# Altium schematic sheet SEAx_connector.SchDoc
size A3
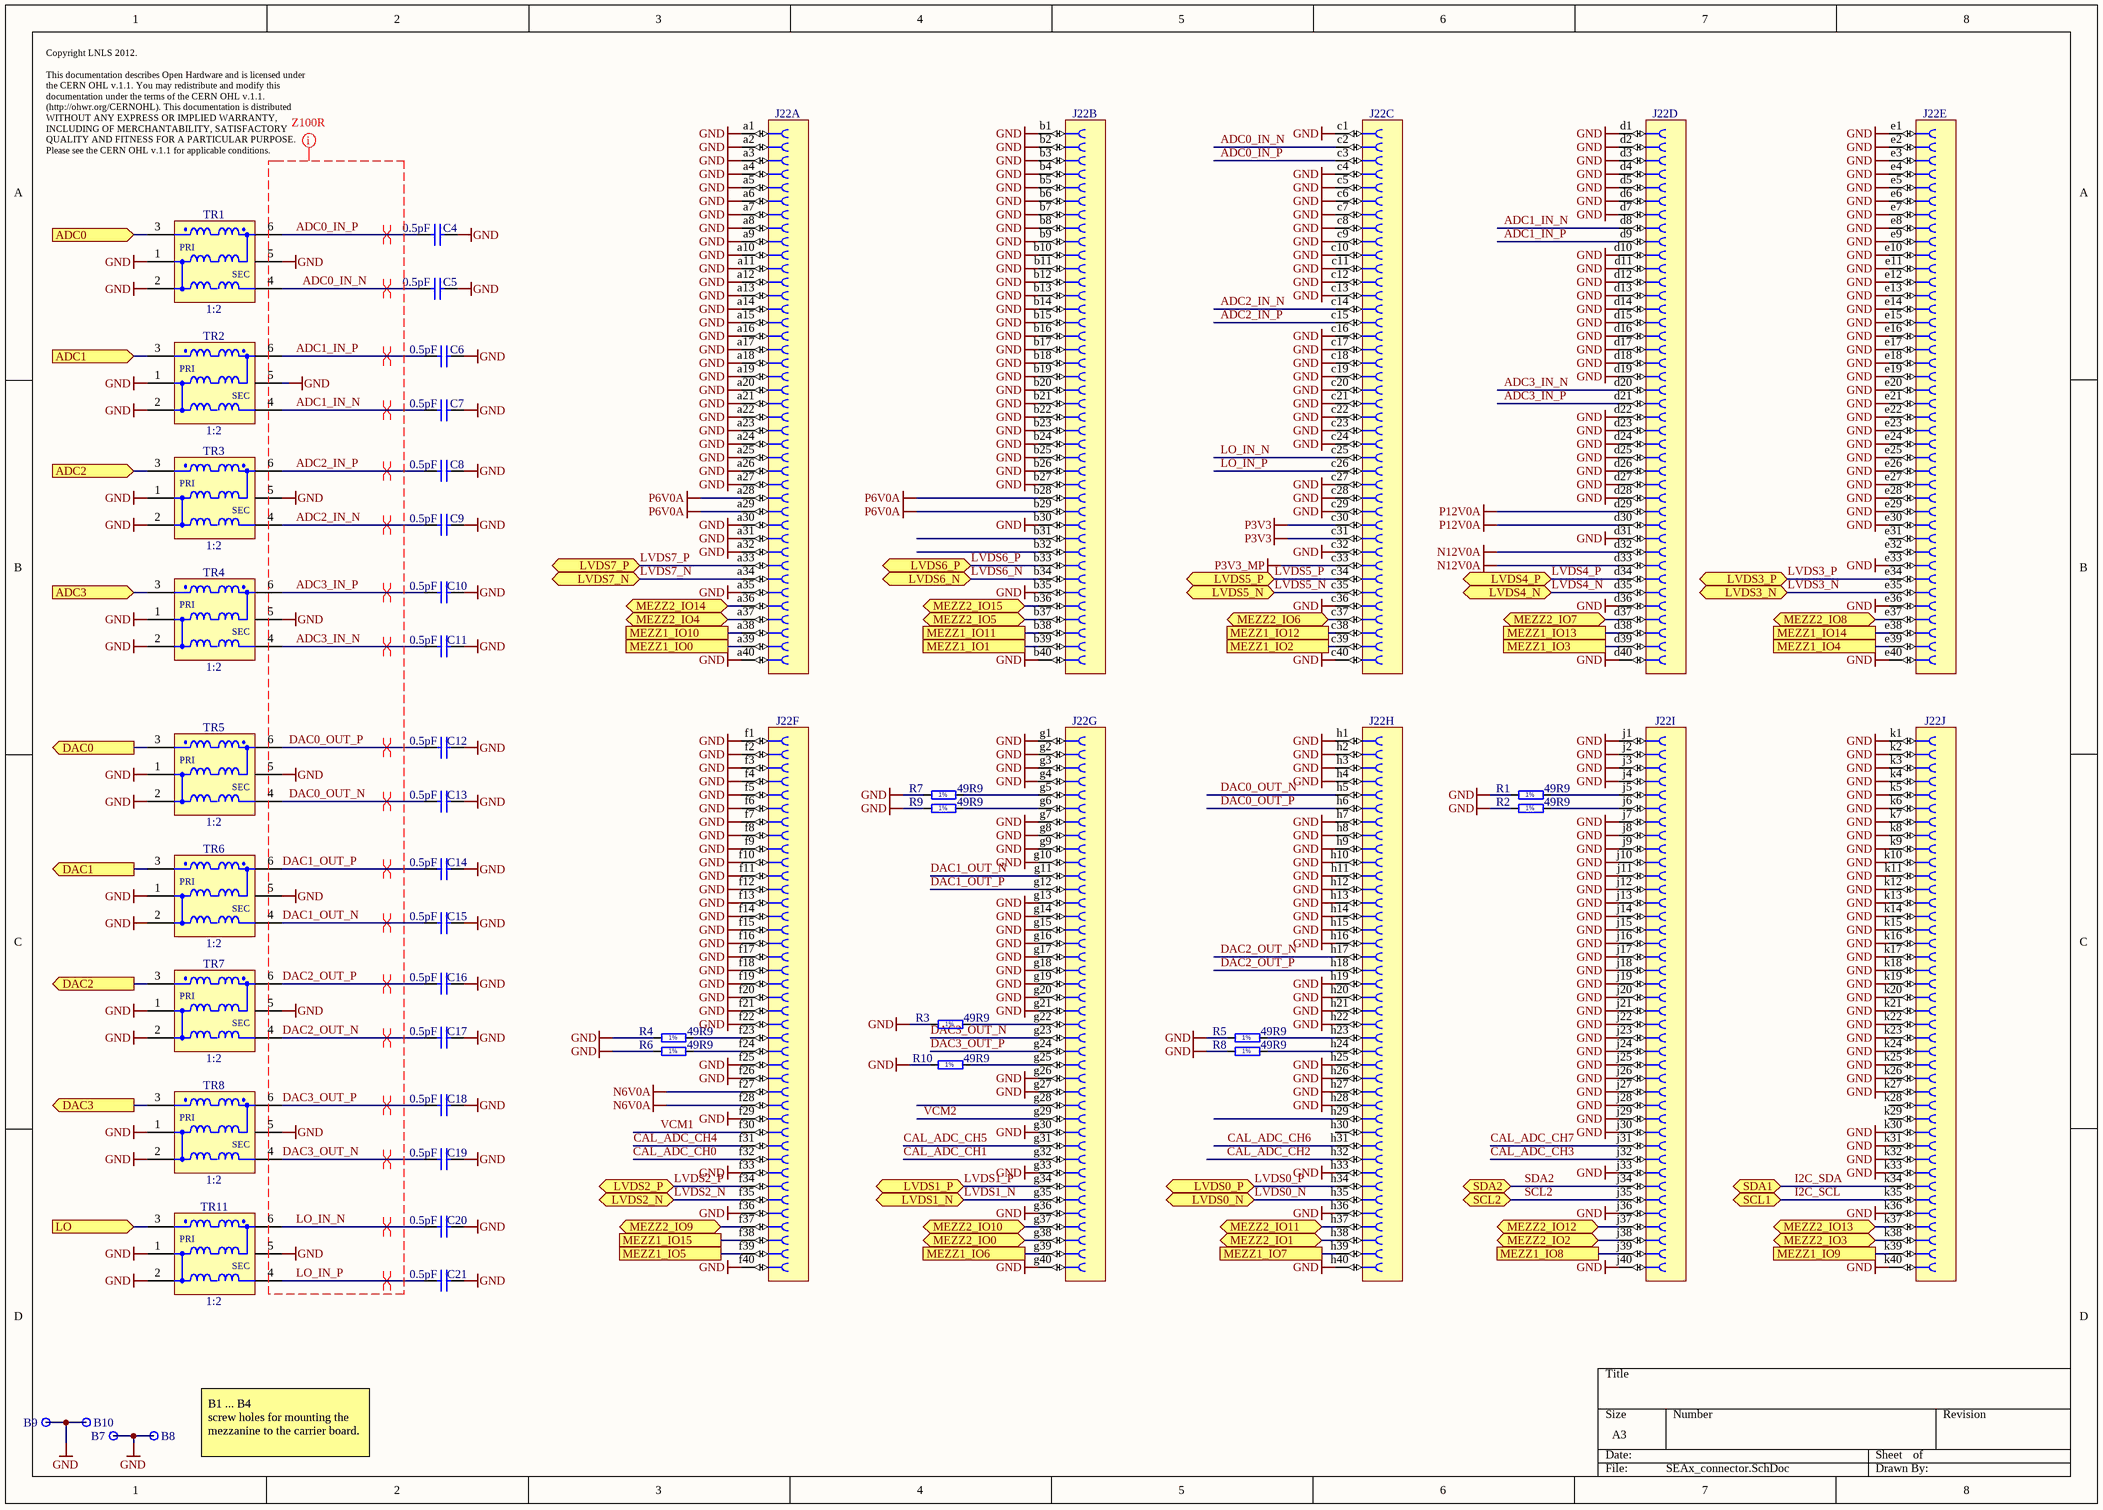
[diagram p0: SEAx_connector.SchDoc]

## Parts
B7  Plated Hole  [MTG270_500]  (value not drawn)
B8  Plated Hole  [MTG270_500]  (value not drawn)
B9  Plated Hole  [MTG270_500]  (value not drawn)
B10  Plated Hole  [MTG270_500]  (value not drawn)
C4  0.5pF  [CAPC1005X50N]
C5  0.5pF  [CAPC1005X50N]
C6  0.5pF  [CAPC1005X50N]
C7  0.5pF  [CAPC1005X50N]
C8  0.5pF  [CAPC1005X50N]
C9  0.5pF  [CAPC1005X50N]
C10  0.5pF  [CAPC1005X50N]
C11  0.5pF  [CAPC1005X50N]
C12  0.5pF  [CAPC1005X50N]
C13  0.5pF  [CAPC1005X50N]
C14  0.5pF  [CAPC1005X50N]
C15  0.5pF  [CAPC1005X50N]
C16  0.5pF  [CAPC1005X50N]
C17  0.5pF  [CAPC1005X50N]
C18  0.5pF  [CAPC1005X50N]
C19  0.5pF  [CAPC1005X50N]
C20  0.5pF  [CAPC1005X50N]
C21  0.5pF  [CAPC1005X50N]
J22  VITA 57  [SAMTEC_ASP-134486-01]  (value not drawn)  (parts A,B,C,D,E,F,G,H,I,J of 10)
R1  49R9  [RESC1005X40N]
R2  49R9  [RESC1005X40N]
R3  49R9  [RESC1005X40N]
R4  49R9  [RESC1005X40N]
R5  49R9  [RESC1005X40N]
R6  49R9  [RESC1005X40N]
R7  49R9  [RESC1005X40N]
R8  49R9  [RESC1005X40N]
R9  49R9  [RESC1005X40N]
R10  49R9  [RESC1005X40N]
TR1  1:2  [XFMR_MINI-CIRCUITS_DB1627]
TR2  1:2  [XFMR_MINI-CIRCUITS_DB1627]
TR3  1:2  [XFMR_MINI-CIRCUITS_DB1627]
TR4  1:2  [XFMR_MINI-CIRCUITS_DB1627]
TR5  1:2  [XFMR_MINI-CIRCUITS_DB1627]
TR6  1:2  [XFMR_MINI-CIRCUITS_DB1627]
TR7  1:2  [XFMR_MINI-CIRCUITS_DB1627]
TR8  1:2  [XFMR_MINI-CIRCUITS_DB1627]
TR11  1:2  [XFMR_MINI-CIRCUITS_DB1627]

## Ports
ADC0 (in), ADC1 (in), ADC2 (in), ADC3 (in), DAC0 (out), DAC1 (out), DAC2 (out), DAC3 (out), LO (in), LVDS0_N (bidir), LVDS0_P (bidir), LVDS1_N (bidir), LVDS1_P (bidir), LVDS2_N (bidir), LVDS2_P (bidir), LVDS3_N (bidir), LVDS3_P (bidir), LVDS4_N (bidir), LVDS4_P (bidir), LVDS5_N (bidir), LVDS5_P (bidir), LVDS6_N (bidir), LVDS6_P (bidir), LVDS7_N (bidir), LVDS7_P (bidir), MEZZ1_IO0, MEZZ1_IO1, MEZZ1_IO2, MEZZ1_IO3, MEZZ1_IO4, MEZZ1_IO5, MEZZ1_IO6, MEZZ1_IO7, MEZZ1_IO8, MEZZ1_IO9, MEZZ1_IO10, MEZZ1_IO11, MEZZ1_IO12, MEZZ1_IO13, MEZZ1_IO14, MEZZ1_IO15, MEZZ2_IO0 (bidir), MEZZ2_IO1 (bidir), MEZZ2_IO2 (bidir), MEZZ2_IO3 (bidir), MEZZ2_IO4 (bidir), MEZZ2_IO5 (bidir), MEZZ2_IO6 (bidir), MEZZ2_IO7 (bidir), MEZZ2_IO8 (bidir), MEZZ2_IO9 (bidir), MEZZ2_IO10 (bidir), MEZZ2_IO11 (bidir), MEZZ2_IO12 (bidir), MEZZ2_IO13 (bidir), MEZZ2_IO14 (bidir), MEZZ2_IO15 (bidir), SCL1 (bidir), SCL2 (bidir), SDA1 (bidir), SDA2 (bidir)

## Nets
GND: B7.1 B8.1 B9.1 B10.1 C4.2 C5.2 C6.2 C7.2 C8.2 C9.2 C10.2 C11.2 C12.2 C13.2 C14.2 C15.2 C16.2 C17.2 C18.2 C19.2 C20.2 C21.2 J22.a1 J22.a2 J22.a3 J22.a4 J22.a5 J22.a6 J22.a7 J22.a8 J22.a9 J22.a10 J22.a11 J22.a12 J22.a13 J22.a14 J22.a15 J22.a16 J22.a17 J22.a18 J22.a19 J22.a20 J22.a21 J22.a22 J22.a23 J22.a24 J22.a25 J22.a26 J22.a27 J22.a30 J22.a31 J22.a32 J22.a35 J22.a40 J22.b1 J22.b2 J22.b3 J22.b4 J22.b5 J22.b6 J22.b7 J22.b8 J22.b9 J22.b10 J22.b11 J22.b12 J22.b13 J22.b14 J22.b15 J22.b16 J22.b17 J22.b18 J22.b19 J22.b20 J22.b21 J22.b22 J22.b23 J22.b24 J22.b25 J22.b26 J22.b27 J22.b30 J22.b35 J22.b40 J22.c1 J22.c4 J22.c5 J22.c6 J22.c7 J22.c8 J22.c9 J22.c10 J22.c11 J22.c12 J22.c13 J22.c16 J22.c17 J22.c18 J22.c19 J22.c20 J22.c21 J22.c22 J22.c23 J22.c24 J22.c27 J22.c28 J22.c29 J22.c32 J22.c36 J22.c40 J22.d1 J22.d2 J22.d3 J22.d4 J22.d5 J22.d6 J22.d7 J22.d10 J22.d11 J22.d12 J22.d13 J22.d14 J22.d15 J22.d16 J22.d17 J22.d18 J22.d19 J22.d22 J22.d23 J22.d24 J22.d25 J22.d26 J22.d27 J22.d28 J22.d31 J22.d36 J22.d40 J22.e1 J22.e2 J22.e3 J22.e4 J22.e5 J22.e6 J22.e7 J22.e8 J22.e9 J22.e10 J22.e11 J22.e12 J22.e13 J22.e14 J22.e15 J22.e16 J22.e17 J22.e18 J22.e19 J22.e20 J22.e21 J22.e22 J22.e23 J22.e24 J22.e25 J22.e26 J22.e27 J22.e28 J22.e29 J22.e30 J22.e33 J22.e36 J22.e40 J22.f1 J22.f2 J22.f3 J22.f4 J22.f5 J22.f6 J22.f7 J22.f8 J22.f9 J22.f10 J22.f11 J22.f12 J22.f13 J22.f14 J22.f15 J22.f16 J22.f17 J22.f18 J22.f19 J22.f20 J22.f21 J22.f22 J22.f25 J22.f26 J22.f29 J22.f33 J22.f36 J22.f40 J22.g1 J22.g2 J22.g3 J22.g4 J22.g7 J22.g8 J22.g9 J22.g10 J22.g13 J22.g14 J22.g15 J22.g16 J22.g17 J22.g18 J22.g19 J22.g20 J22.g21 J22.g26 J22.g27 J22.g30 J22.g33 J22.g36 J22.g40 J22.h1 J22.h2 J22.h3 J22.h4 J22.h7 J22.h8 J22.h9 J22.h10 J22.h11 J22.h12 J22.h13 J22.h14 J22.h15 J22.h16 J22.h19 J22.h20 J22.h21 J22.h22 J22.h25 J22.h26 J22.h27 J22.h28 J22.h33 J22.h36 J22.h40 J22.j1 J22.j2 J22.j3 J22.j4 J22.j7 J22.j8 J22.j9 J22.j10 J22.j11 J22.j12 J22.j13 J22.j14 J22.j15 J22.j16 J22.j17 J22.j18 J22.j19 J22.j20 J22.j21 J22.j22 J22.j23 J22.j24 J22.j25 J22.j26 J22.j27 J22.j28 J22.j29 J22.j30 J22.j33 J22.j36 J22.j40 J22.k1 J22.k2 J22.k3 J22.k4 J22.k5 J22.k6 J22.k7 J22.k8 J22.k9 J22.k10 J22.k11 J22.k12 J22.k13 J22.k14 J22.k15 J22.k16 J22.k17 J22.k18 J22.k19 J22.k20 J22.k21 J22.k22 J22.k23 J22.k24 J22.k25 J22.k26 J22.k27 J22.k30 J22.k31 J22.k32 J22.k33 J22.k36 J22.k40 R1.1 R2.1 R3.1 R4.1 R5.1 R6.1 R7.1 R8.1 R9.1 R10.1 TR1.1(P1) TR1.2(P1) TR1.5(NC) TR2.1(P1) TR2.2(P1) TR2.5(NC) TR3.1(P1) TR3.2(P1) TR3.5(NC) TR4.1(P1) TR4.2(P1) TR4.5(NC) TR5.1(P1) TR5.2(P1) TR5.5(NC) TR6.1(P1) TR6.2(P1) TR6.5(NC) TR7.1(P1) TR7.2(P1) TR7.5(NC) TR8.1(P1) TR8.2(P1) TR8.5(NC) TR11.1(P1) TR11.2(P1) TR11.5(NC)
N6V0A: J22.f27 J22.f28
N12V0A: J22.d32 J22.d33
P3V3: J22.c30 J22.c31
P3V3_MP: J22.c33
P6V0A: J22.a28 J22.a29 J22.b28 J22.b29
P12V0A: J22.d29 J22.d30
ADC0: TR1.3(P1) ; port ADC0
ADC0_IN_N: C5.1 J22.c2 TR1.4(S1)
ADC0_IN_P: C4.1 J22.c3 TR1.6(S1)
ADC1: TR2.3(P1) ; port ADC1
ADC1_IN_N: C7.1 J22.d8 TR2.4(S1)
ADC1_IN_P: C6.1 J22.d9 TR2.6(S1)
ADC2: TR3.3(P1) ; port ADC2
ADC2_IN_N: C9.1 J22.c14 TR3.4(S1)
ADC2_IN_P: C8.1 J22.c15 TR3.6(S1)
ADC3: TR4.3(P1) ; port ADC3
ADC3_IN_N: C11.1 J22.d20 TR4.4(S1)
ADC3_IN_P: C10.1 J22.d21 TR4.6(S1)
CAL_ADC_CH0: J22.f32
CAL_ADC_CH1: J22.g32
CAL_ADC_CH2: J22.h32
CAL_ADC_CH3: J22.j32
CAL_ADC_CH4: J22.f31
CAL_ADC_CH5: J22.g31
CAL_ADC_CH6: J22.h31
CAL_ADC_CH7: J22.j31
DAC0: TR5.3(P1) ; port DAC0
DAC0_OUT_N: C13.1 J22.h5 TR5.4(S1)
DAC0_OUT_P: C12.1 J22.h6 TR5.6(S1)
DAC1: TR6.3(P1) ; port DAC1
DAC1_OUT_N: C15.1 J22.g11 TR6.4(S1)
DAC1_OUT_P: C14.1 J22.g12 TR6.6(S1)
DAC2: TR7.3(P1) ; port DAC2
DAC2_OUT_N: C17.1 J22.h17 TR7.4(S1)
DAC2_OUT_P: C16.1 J22.h18 TR7.6(S1)
DAC3: TR8.3(P1) ; port DAC3
DAC3_OUT_N: C19.1 J22.g23 TR8.4(S1)
DAC3_OUT_P: C18.1 J22.g24 TR8.6(S1)
I2C_SCL: J22.k35 ; port SCL1
I2C_SDA: J22.k34 ; port SDA1
LO: TR11.3(P1) ; port LO
LO_IN_N: C20.1 J22.c25 TR11.6(S1)
LO_IN_P: C21.1 J22.c26 TR11.4(S1)
LVDS0_N: J22.h35 ; port LVDS0_N
LVDS0_P: J22.h34 ; port LVDS0_P
LVDS1_N: J22.g35 ; port LVDS1_N
LVDS1_P: J22.g34 ; port LVDS1_P
LVDS2_N: J22.f35 ; port LVDS2_N
LVDS2_P: J22.f34 ; port LVDS2_P
LVDS3_N: J22.e35 ; port LVDS3_N
LVDS3_P: J22.e34 ; port LVDS3_P
LVDS4_N: J22.d35 ; port LVDS4_N
LVDS4_P: J22.d34 ; port LVDS4_P
LVDS5_N: J22.c35 ; port LVDS5_N
LVDS5_P: J22.c34 ; port LVDS5_P
LVDS6_N: J22.b34 ; port LVDS6_N
LVDS6_P: J22.b33 ; port LVDS6_P
LVDS7_N: J22.a34 ; port LVDS7_N
LVDS7_P: J22.a33 ; port LVDS7_P
MEZZ1_IO0: J22.a39 ; port MEZZ1_IO0
MEZZ1_IO1: J22.b39 ; port MEZZ1_IO1
MEZZ1_IO2: J22.c39 ; port MEZZ1_IO2
MEZZ1_IO3: J22.d39 ; port MEZZ1_IO3
MEZZ1_IO4: J22.e39 ; port MEZZ1_IO4
MEZZ1_IO5: J22.f39 ; port MEZZ1_IO5
MEZZ1_IO6: J22.g39 ; port MEZZ1_IO6
MEZZ1_IO7: J22.h39 ; port MEZZ1_IO7
MEZZ1_IO8: J22.j39 ; port MEZZ1_IO8
MEZZ1_IO9: J22.k39 ; port MEZZ1_IO9
MEZZ1_IO10: J22.a38 ; port MEZZ1_IO10
MEZZ1_IO11: J22.b38 ; port MEZZ1_IO11
MEZZ1_IO12: J22.c38 ; port MEZZ1_IO12
MEZZ1_IO13: J22.d38 ; port MEZZ1_IO13
MEZZ1_IO14: J22.e38 ; port MEZZ1_IO14
MEZZ1_IO15: J22.f38 ; port MEZZ1_IO15
MEZZ2_IO0: J22.g38 ; port MEZZ2_IO0
MEZZ2_IO1: J22.h38 ; port MEZZ2_IO1
MEZZ2_IO2: J22.j38 ; port MEZZ2_IO2
MEZZ2_IO3: J22.k38 ; port MEZZ2_IO3
MEZZ2_IO4: J22.a37 ; port MEZZ2_IO4
MEZZ2_IO5: J22.b37 ; port MEZZ2_IO5
MEZZ2_IO6: J22.c37 ; port MEZZ2_IO6
MEZZ2_IO7: J22.d37 ; port MEZZ2_IO7
MEZZ2_IO8: J22.e37 ; port MEZZ2_IO8
MEZZ2_IO9: J22.f37 ; port MEZZ2_IO9
MEZZ2_IO10: J22.g37 ; port MEZZ2_IO10
MEZZ2_IO11: J22.h37 ; port MEZZ2_IO11
MEZZ2_IO12: J22.j37 ; port MEZZ2_IO12
MEZZ2_IO13: J22.k37 ; port MEZZ2_IO13
MEZZ2_IO14: J22.a36 ; port MEZZ2_IO14
MEZZ2_IO15: J22.b36 ; port MEZZ2_IO15
SCL2: J22.j35 ; port SCL2
SDA2: J22.j34 ; port SDA2
VCM1: J22.f30
VCM2: J22.g29
NetJ22_f23: J22.f23 R4.2
NetJ22_f24: J22.f24 R6.2
NetJ22_g5: J22.g5 R7.2
NetJ22_g6: J22.g6 R9.2
NetJ22_g22: J22.g22 R3.2
NetJ22_g25: J22.g25 R10.2
NetJ22_h23: J22.h23 R5.2
NetJ22_h24: J22.h24 R8.2
NetJ22_j5: J22.j5 R1.2
NetJ22_j6: J22.j6 R2.2

Not connected (* = marked no-connect by the designer): J22 b31 b32 e31 e32 g28 h29 h30 k28 k29

## Layout directives
differential pair: ADC0_IN_N, ADC0_IN_P, ADC1_IN_N, ADC1_IN_P, ADC2_IN_N, ADC2_IN_P, ADC3_IN_N, ADC3_IN_P, DAC0_OUT_N, DAC0_OUT_P, DAC1_OUT_N, DAC1_OUT_P, DAC2_OUT_N, DAC2_OUT_P, DAC3_OUT_N, DAC3_OUT_P, LO_IN_N, LO_IN_P
rule Differential Pairs Routing [Pref Gap = 12mil    Min Gap  = 12mil    Max Gap  = 12milPref Width = 14mil    Min Width  = 14mil    Max Width  = 14mil]: ADC0_IN_N, ADC0_IN_P, ADC1_IN_N, ADC1_IN_P, ADC2_IN_N, ADC2_IN_P, ADC3_IN_N, ADC3_IN_P, DAC0_OUT_N, DAC0_OUT_P, DAC1_OUT_N, DAC1_OUT_P, DAC2_OUT_N, DAC2_OUT_P, DAC3_OUT_N, DAC3_OUT_P, GND, LO_IN_N, LO_IN_P

## Notes on the sheet
- Copyright LNLS 2012.
  This documentation describes Open Hardware and is licensed under the CERN OHL v.1.1. You may redistribute and modify this documentation under the terms of the CERN OHL v.1.1. (http://ohwr.org/CERNOHL). This documentation is distributed WITHOUT ANY EXPRESS OR IMPLIED WARRANTY, INCLUDING OF MERCHANTABILITY, SATISFACTORY QUALITY AND FITNESS FOR A PARTICULAR PURPOSE. Please see the CERN OHL v.1.1 for applicable conditions.
- (near B8) B1 ... B4
  screw holes for mounting the mezzanine to the carrier board.
- (in symbol R0402_49R9_1%_0.0625W_100PPM) 1%
- (in symbol XFMR_MINI-CIRCUITS_TCM2-43X+) PRI; SEC

## Library data of the parts
B7-B10 = PLATED_HOLE2.7_PAD5.0: Single Terminal Socket; Part Description: Plated Through Hole: Hole Dia.=2.7mm Pad Dia.=5.0mm; Mounted: No; Part Number: PLATED_HOLE2.7_PAD5.0; Component Kind: Standard (No BOM); Component Type: Standard (No BOM); Pin Count: 1; Family: Plated Hole; Socket: No; SMD: No; Sense: No; Status: None; ComponentHeight: 0mm; HelpURL: Undefined; Author: CERN DEM JMW; CreateDate: 27.09.2011; LatestRevisionDate: 27.09.2011; PackageDescription: Plated Through Hole: Hole Dia.=2.7mm Pad Dia.=5.0mm
C4-C21 = CC0402_0.5PF_25V_0.05PF_AVX_04023J0R5ABSTR: Non-polarised capacitor; Part Description: Thin-Film Chip Capacitors for RF Signal and Power Applications, Accu-P Series; Manufacturer: AVX; Voltage: 25V; Tolerance: ±0.05pF; Part Number: CC0402_0.5PF_25V_0.05PF_AVX_04023J0R5ABSTR; Component Kind: Standard; Component Type: Standard; Pin Count: 2; Value: 0.5pF; Status: None; Manufacturer Part Number: 04023J0R5ABSTR; Case: 0402; Mounted: Yes; Socket: No; SMD: Yes; Sense: No; ComponentHeight: 0.5mm; HelpURL: \\cern.ch\dfs\Applications\Altium\Datasheets\CC0402_AVX_ACCU-P.pdf; Author: CERN DEM JLC; CreateDate: 22.02.2017; LatestRevisionDate: 22.02.2017
J22 = SAMTEC_ASP-134486-01: Connector VITA 57, 400 Female contacts in 10 row abcdefghj; Part Description: 400 contacts (10 rows abcdefghj) Surface Mount Female Connector, VITA 57 (CC-HPC-10); Manufacturer: SAMTEC; PressFit: No; Part Number: SAMTEC_ASP-134486-01; Component Kind: Standard; Component Type: Standard; Pin Count: 400; Family: VITA 57; Mounted: Yes; Socket: No; SMD: Yes; Status: None; Manufacturer Part Number: ASP-134486-01; ComponentHeight: 6.55mm; HelpURL: \\cern.ch\dfs\Applications\Altium\Datasheets\SAMTEC_ASP-134486-01.pdf; Author: CERN DEM JLC; CreateDate: 30.04.2009; LatestRevisionDate: 17.08.2009; Sense: No
R1-R10 = R0402_49R9_1%_0.0625W_100PPM: Resistor - 1%; Part Description: General Purpose Thick Film Chip Resistor; Manufacturer: GENERIC; Manufacturer1 Part Number: 232270674999L or RC0402FR-0749R9L; TC: ±100ppm/°C; PressFit: No; Part Number: R0402_49R9_1%_0.0625W_100PPM; Component Kind: Standard; Component Type: Standard; Pin Count: 2; Value: 49R9; Status: Not Recommended; Power: 0.0625W; Tolerance: ±1%; Manufacturer Part Number: R0402_49R9_1%_0.0625W_100PPM; Case: 0402; Mounted: Yes; Sense: No; Socket: No; SMD: Yes; Manufacturer1 Example: YAGEO PHYCOMP; Manufacturer1 ComponentHeight: 0.4mm; HelpURL: \\cern.ch\dfs\Applications\Altium\Datasheets\R0402_Phycomp_RC0402.pdf; Author: CERN DEM JLC; CreateDate: 24.10.2012; LatestRevisionDate: 24.10.2012
TR1-TR8 TR11 = XFMR_MINI-CIRCUITS_TCM2-43X+: 50 OHMS 10 to 4000 MHz RF Transformer; Power: 0.4W; Part Number: XFMR_MINI-CIRCUITS_TCM2-43X+; Component Kind: Standard; Component Type: Standard; Pin Count: 6; Value: 1:2; Status: None; Part Description: 50 Ohms 10 to 4000MHz RF Transformer; Manufacturer: MINI-CIRCUITS; Manufacturer Part Number: TCM2-43X+; Mounted: Yes; Socket: No; Sense: No; SMD: Yes; ComponentHeight: 4.06mm; HelpURL: \\cern.ch\dfs\Applications\Altium\Datasheets\XFMR_MINI-CIRCUITS_TCM2-43X+.pdf; Author: CERN DEM BC; CreateDate: 12.02.2016; LatestRevisionDate: 12.02.2016